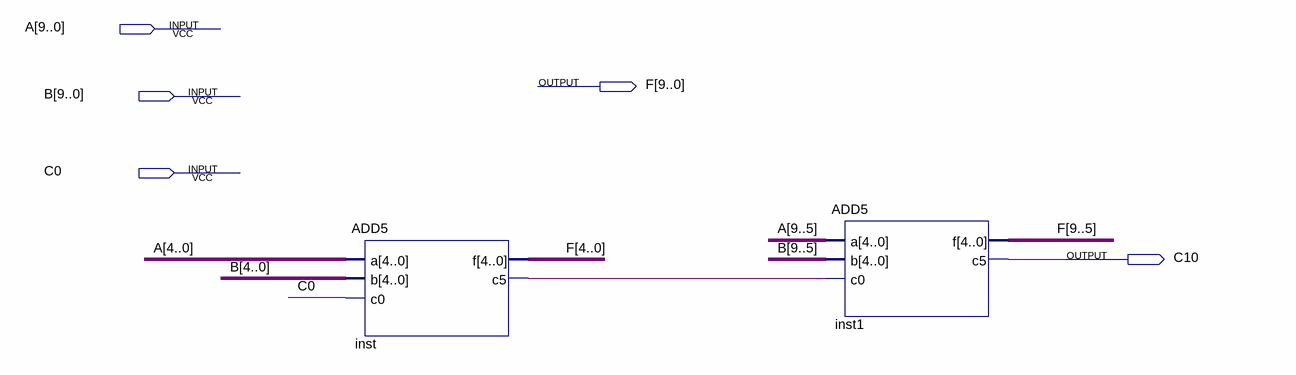
[diagram p0: schematic sheet]
// Quartus schematic ADD10.bdf as structural Verilog: 2 symbols, 5 pins
module ADD10 (
  input  [9:0] A,
  input  [9:0] B,
  input  C0,
  output [9:0] F,
  output C10
);

  wire inst_c5;

  ADD5 inst (.a(A[4:0]), .b(B[4:0]), .c0(C0), .f(F[4:0]), .c5(inst_c5));
  ADD5 inst1 (.a(A[9:5]), .b(B[9:5]), .c0(inst_c5), .f(F[9:5]), .c5(C10));
endmodule
